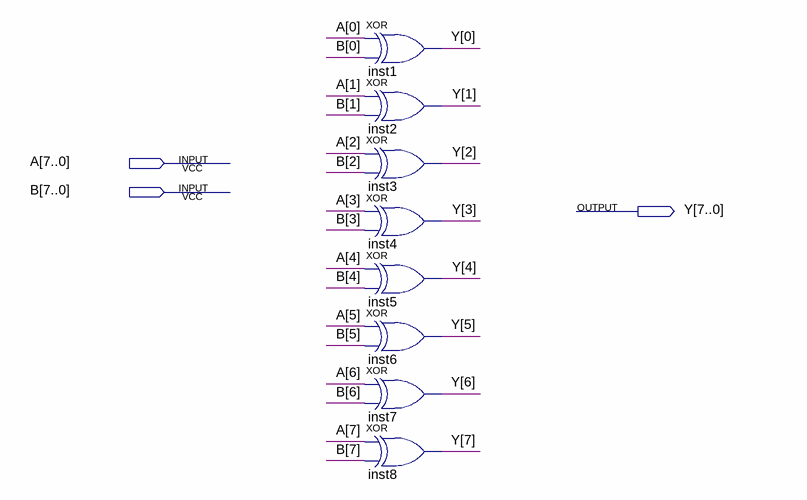
[diagram p0: schematic sheet]
// Quartus schematic xor8bit.bdf as structural Verilog: 8 symbols, 3 pins
module xor8bit (
  input  [7:0] A,
  input  [7:0] B,
  output [7:0] Y
);

  xor inst1 (Y[0], A[0], B[0]);
  xor inst2 (Y[1], A[1], B[1]);
  xor inst3 (Y[2], A[2], B[2]);
  xor inst4 (Y[3], A[3], B[3]);
  xor inst5 (Y[4], A[4], B[4]);
  xor inst6 (Y[5], A[5], B[5]);
  xor inst7 (Y[6], A[6], B[6]);
  xor inst8 (Y[7], A[7], B[7]);
endmodule
